# EAGLE design relay-attentuator (EAGLE 6.4)
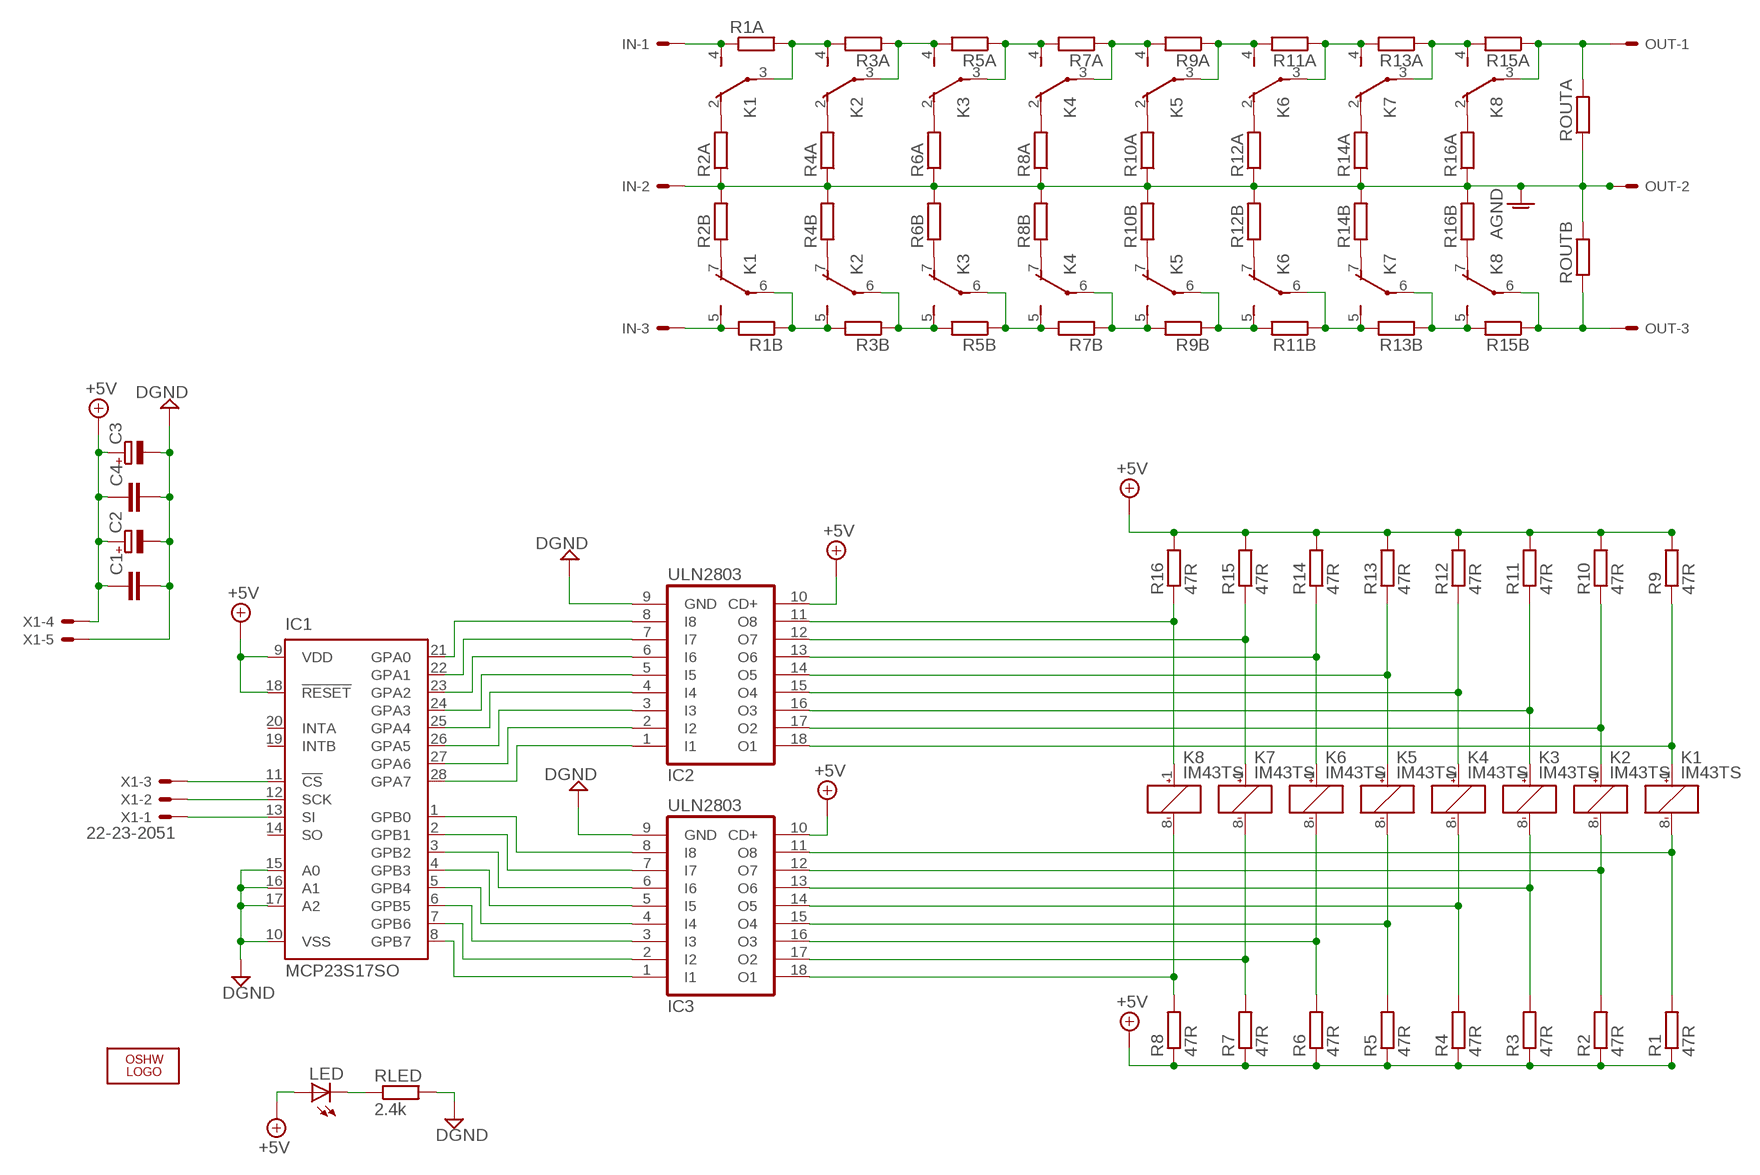
[diagram p0: schematic, sheet 1]

## Parts
C1  C-EUC1206  [C1206]
C2  CPOL-EUE3.5-8  [E3,5-8]
C3  CPOL-EUE3.5-8  [E3,5-8]
C4  C-EUC1206  [C1206]
IC1  MCP23S17SO  [SO28W]
IC2  ULN2803  ULN2803ADW  [SO-18W]
IC3  ULN2803  ULN2803ADW  [SO-18W]
IN  22-23-2031  [22-23-2031]
K1  IM43TS  [IM43TS]
K2  IM43TS  [IM43TS]
K3  IM43TS  [IM43TS]
K4  IM43TS  [IM43TS]
K5  IM43TS  [IM43TS]
K6  IM43TS  [IM43TS]
K7  IM43TS  [IM43TS]
K8  IM43TS  [IM43TS]
LED  LEDCHIPLED_1206  [CHIPLED_1206]
LOGO1  OSHW_LOGO_FILLX0200-NT  [OSHW_FILLX200_NOTEXT]
OUT  22-23-2031  [22-23-2031]
R1  47R  R-EU_R1206  [R1206]
R1A  R-EU_R1206  [R1206]
R1B  R-EU_R1206  [R1206]
R2  47R  R-EU_R1206  [R1206]
R2A  R-EU_R1206  [R1206]
R2B  R-EU_R1206  [R1206]
R3  47R  R-EU_R1206  [R1206]
R3A  R-EU_R1206  [R1206]
R3B  R-EU_R1206  [R1206]
R4  47R  R-EU_R1206  [R1206]
R4A  R-EU_R1206  [R1206]
R4B  R-EU_R1206  [R1206]
R5  47R  R-EU_R1206  [R1206]
R5A  R-EU_R1206  [R1206]
R5B  R-EU_R1206  [R1206]
R6  47R  R-EU_R1206  [R1206]
R6A  R-EU_R1206  [R1206]
R6B  R-EU_R1206  [R1206]
R7  47R  R-EU_R1206  [R1206]
R7A  R-EU_R1206  [R1206]
R7B  R-EU_R1206  [R1206]
R8  47R  R-EU_R1206  [R1206]
R8A  R-EU_R1206  [R1206]
R8B  R-EU_R1206  [R1206]
R9  47R  R-EU_R1206  [R1206]
R9A  R-EU_R1206  [R1206]
R9B  R-EU_R1206  [R1206]
R10  47R  R-EU_R1206  [R1206]
R10A  R-EU_R1206  [R1206]
R10B  R-EU_R1206  [R1206]
R11  47R  R-EU_R1206  [R1206]
R11A  R-EU_R1206  [R1206]
R11B  R-EU_R1206  [R1206]
R12  47R  R-EU_R1206  [R1206]
R12A  R-EU_R1206  [R1206]
R12B  R-EU_R1206  [R1206]
R13  47R  R-EU_R1206  [R1206]
R13A  R-EU_R1206  [R1206]
R13B  R-EU_R1206  [R1206]
R14  47R  R-EU_R1206  [R1206]
R14A  R-EU_R1206  [R1206]
R14B  R-EU_R1206  [R1206]
R15  47R  R-EU_R1206  [R1206]
R15A  R-EU_R1206  [R1206]
R15B  R-EU_R1206  [R1206]
R16  47R  R-EU_R1206  [R1206]
R16A  R-EU_R1206  [R1206]
R16B  R-EU_R1206  [R1206]
RLED  2.4k  R-EU_R1206  [R1206]
ROUTA  R-EU_R1206  [R1206]
ROUTB  R-EU_R1206  [R1206]
X1  22-23-2051  [22-23-2051]

## Nets
+5V: C1.1 C2.+ C3.+ C4.1 IC1.9(VDD) IC1.18(!RESET) IC2.10(CD+) IC3.10(CD+) LED.A R1.1 R2.1 R3.1 R4.1 R5.1 R6.1 R7.1 R8.1 R9.2 R10.2 R11.2 R12.2 R13.2 R14.2 R15.2 R16.2 X1.4
AGND: IN.2 OUT.2 R2A.1 R2B.2 R4A.1 R4B.2 R6A.1 R6B.2 R8A.1 R8B.2 R10A.1 R10B.2 R12A.1 R12B.2 R14A.1 R14B.2 R16A.1 R16B.2 ROUTA.1 ROUTB.2
ATT_INL: IN.1 K1.4(2:S) R1A.1
ATT_INR: IN.3 K1.5(3:S) R1B.2
CS: IC1.11(!CS) X1.3
DGND: C1.2 C2.- C3.- C4.2 IC1.10(VSS) IC1.15(A0) IC1.16(A1) IC1.17(A2) IC2.9(GND) IC3.9(GND) RLED.2 X1.5
N$1: IC2.11(O8) K8.1(1:+) R16.1
N$2: IC3.11(O8) K1.8(1:-) R1.2
N$3: IC3.17(O2) K7.8(1:-) R7.2
N$4: IC3.13(O6) K3.8(1:-) R3.2
N$5: IC3.14(O5) K4.8(1:-) R4.2
N$6: K2.7(3:O) R4B.1
N$7: K1.7(3:O) R2B.1
N$8: K1.2(2:O) R2A.2
N$9: IC3.18(O1) K8.8(1:-) R8.2
N$10: IC2.12(O7) K7.1(1:+) R15.1
N$11: IC2.13(O6) K6.1(1:+) R14.1
N$12: IC2.14(O5) K5.1(1:+) R13.1
N$13: IC2.15(O4) K4.1(1:+) R12.1
N$14: IC2.16(O3) K3.1(1:+) R11.1
N$15: IC2.17(O2) K2.1(1:+) R10.1
N$16: IC2.18(O1) K1.1(1:+) R9.1
N$17: K3.7(3:O) R6B.1
N$18: IC3.12(O7) K2.8(1:-) R2.2
N$19: IC3.16(O3) K6.8(1:-) R6.2
N$20: IC3.15(O4) K5.8(1:-) R5.2
N$21: K4.7(3:O) R8B.1
N$22: K5.7(3:O) R10B.1
N$23: K6.7(3:O) R12B.1
N$24: K7.7(3:O) R14B.1
N$25: K8.7(3:O) R16B.1
N$26: K2.2(2:O) R4A.2
N$27: K3.2(2:O) R6A.2
N$28: K4.2(2:O) R8A.2
N$29: K5.2(2:O) R10A.2
N$30: K6.2(2:O) R12A.2
N$31: K7.2(2:O) R14A.2
N$32: K8.2(2:O) R16A.2
N$33: IC1.28(GPA7) IC2.1(I1)
N$34: IC1.27(GPA6) IC2.2(I2)
N$35: IC1.26(GPA5) IC2.3(I3)
N$36: IC1.25(GPA4) IC2.4(I4)
N$37: IC1.24(GPA3) IC2.5(I5)
N$38: IC1.23(GPA2) IC2.6(I6)
N$39: IC1.22(GPA1) IC2.7(I7)
N$40: IC1.21(GPA0) IC2.8(I8)
N$41: IC1.8(GPB7) IC3.1(I1)
N$42: IC1.7(GPB6) IC3.2(I2)
N$43: IC1.6(GPB5) IC3.3(I3)
N$44: IC1.5(GPB4) IC3.4(I4)
N$45: IC1.4(GPB3) IC3.5(I5)
N$46: IC1.3(GPB2) IC3.6(I6)
N$47: IC1.2(GPB1) IC3.7(I7)
N$48: IC1.1(GPB0) IC3.8(I8)
N$50: K7.6(3:P) K8.5(3:S) R13B.1 R15B.2
N$52: K7.3(2:P) K8.4(2:S) R13A.1 R15A.2
N$61: K6.6(3:P) K7.5(3:S) R11B.1 R13B.2
N$67: LED.C RLED.1
N$69: K8.6(3:P) OUT.3 R15B.1 ROUTB.1
N$71: K8.3(2:P) OUT.1 R15A.1 ROUTA.2
N$76: K1.3(2:P) K2.4(2:S) R1A.2 R3A.2
N$80: K2.3(2:P) K3.4(2:S) R3A.1 R5A.2
N$82: K1.6(3:P) K2.5(3:S) R1B.1 R3B.2
N$114: K3.3(2:P) K4.4(2:S) R5A.1 R7A.2
N$115: K4.3(2:P) K5.4(2:S) R7A.1 R9A.2
N$116: K5.3(2:P) K6.4(2:S) R9A.1 R11A.2
N$117: K6.3(2:P) K7.4(2:S) R11A.1 R13A.2
N$120: K2.6(3:P) K3.5(3:S) R3B.1 R5B.2
N$121: K3.6(3:P) K4.5(3:S) R5B.1 R7B.2
N$122: K4.6(3:P) K5.5(3:S) R7B.1 R9B.2
N$123: K5.6(3:P) K6.5(3:S) R9B.1 R11B.2
SCK: IC1.12(SCK) X1.2
SI: IC1.13(SI) X1.1
Unconnected: IC1.14(SO) IC1.19(INTB) IC1.20(INTA)

## Library data of the parts
C1 C4 = rcl:C-EU: CAPACITOR, European symbol
C2 C3 = rcl:CPOL-EU: POLARIZED CAPACITOR, European symbol
IC1 = microchip:MCP23S17: http://ww1.microchip.com/downloads/en/DeviceDoc/21952a.pdf Source: http://ww1.microchip.com/downloads/en/DeviceDoc/21952a.pdf; MF: MICROCHIP; MPN: MCP23S17-E/SO; OC_FARNELL: unknown; OC_NEWARK: 31K2950
IC2 IC3 = uln-udn-mine:ULN2803ADW
IN OUT = con-molex:22-23-2031: .100" (2.54mm) Center Header - 3 Pin
K1-K8 = relay-te:IM
LED = led:LED: LED OSRAM: - CHIPLED LG R971, LG N971, LY N971, LG Q971, LY Q971, LO R971, LY R971 LH N974, LH R974 LS Q976, LO Q976, LY Q976 LO Q996 - Hyper CHIPLED LW Q18S LB Q993, LB Q99A, LB R99A - SideLED LS A670, LO A670, LY A670, LG A670, LP A670 LB A673, LV A673, LT A673, LW A673 LH A674 LY A675 LS A676, LA A676, LO A676, LY A676, LW A676 LS A679, LY A679, LG A679 - Hyper Micro SIDELED® LS Y876, LA Y876, LO Y876, LY Y876 LT Y87S - SmartLED LW L88C, LW L88S LB L89C, LB L89S, LG L890 LS L89K, LO L89K, LY L89K LS L896, LA L896, LO L896, LY L896 - TOPLED LS T670, LO T670, LY T670, LG T670, LP T670 LSG T670, LSP T670, LSY T670, LOP T670, LYG T670 LG T671, LOG T671, LSG T671 LB T673, LV T673, LT T673, LW T673 LH T674 LS T676, LA T676, LO T676, LY T676, LB T676, LH T676, LSB T676, LW T676 LB T67C, LV T67C, LT T67C, LS T67K, LO T67K, LY T67K, LW E67C LS E67B, LA E67B, LO E67B, LY E67B, LB E67C, LV E67C, LT E67C LW T67C LS T679, LY T679, LG T679 LS T770, LO T770, LY T770, LG T770, LP T770 LB T773, LV T773, LT T773, LW T773 LH T774 LS E675, LA E675, LY E675, LS T675 LS T776, LA T776, LO T776, LY T776, LB T776 LHGB T686 LT T68C, LB T68C - Hyper Mini TOPLED® LB M676 - Mini TOPLED Santana® LG M470 LS M47K, LO M47K, LY M47K Source: http://www.osram.convergy.de LUXEON: - LUMILED® LXK2-PW12-R00, LXK2-PW12-S00, LXK2-PW14-U00, LXK2-PW14-V00 LXK2-PM12-R00, LXK2-PM12-S00, LXK2-PM14-U00 LXK2-PE12-Q00, LXK2-PE12-R00, LXK2-PE12-S00, LXK2-PE14-T00, LXK2-PE14-U00 LXK2-PB12-K00, LXK2-PB12-L00, LXK2-PB12-M00, LXK2-PB14-N00, LXK2-PB14-P00, LXK2-PB14-Q00 LXK2-PR12-L00, LXK2-PR12-M00, LXK2-PR14-Q00, LXK2-PR14-R00 LXK2-PD12-Q00, LXK2-PD12-R00, LXK2-PD12-S00 LXK2-PH12-R00, LXK2-PH12-S00 LXK2-PL12-P00, LXK2-PL12-Q00, LXK2-PL12-R00 Source: www.luxeon.com KINGBRIGHT: KA-3528ASYC Source: www.kingbright.com
LOGO1 = ohw-logo:OSHW_LOGO_FILL
R1 R1A R1B R2 R2A R2B R3 R3A R3B R4 R4A R4B R5 R5A R5B R6 R6A R6B R7 R7A R7B R8 R8A R8B R9 R9A R9B R10 R10A R10B R11 R11A R11B R12 R12A R12B R13 R13A R13B R14 R14A R14B R15 R15A R15B R16 R16A R16B RLED ROUTA ROUTB = rcl:R-EU_: RESISTOR, European symbol
X1 = con-molex:22-23-2051: .100" (2.54mm) Center Header - 5 Pin; MF: MOLEX; MPN: 22-23-2051; OC_FARNELL: 1462952; OC_NEWARK: 38C9178

## Board
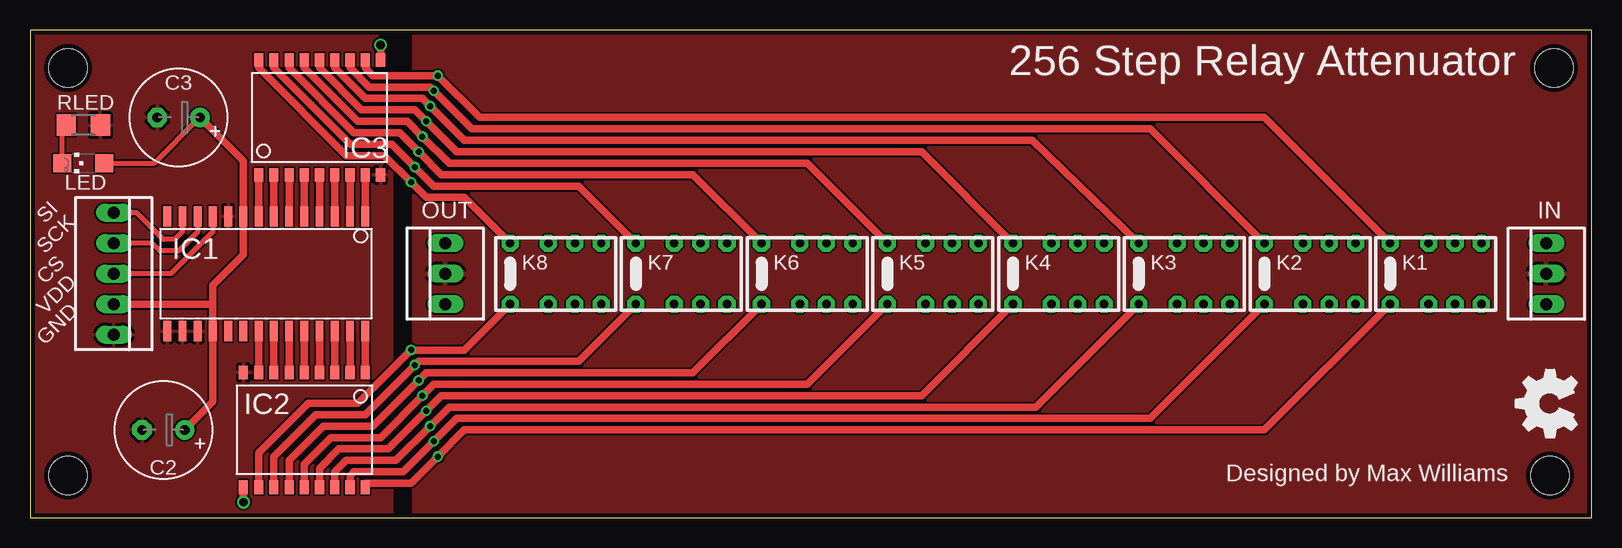
[diagram p1: board, top side]
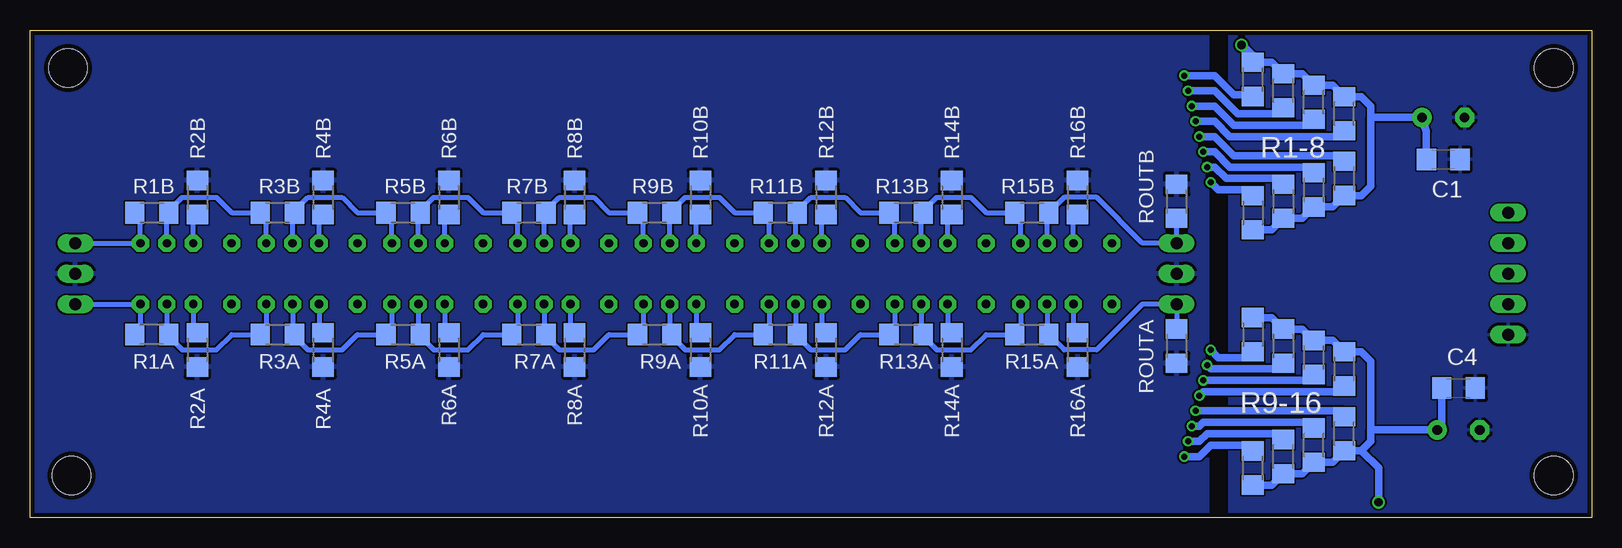
[diagram p2: board, bottom side, seen from below]

Size 130.16 x 40.63 mm. Coordinates in mm from the lower left corner, seen from the top.
Outline: 0,0 130.16,0 130.16,40.63 0,40.63 0,0
Copper layers (1*16): Top 0.0356mm / dielectric 1.5011mm / Bottom 0.0356mm
Design rules "LaenPCBOrder": minimum track width 6mil, minimum drill 13mil, track to track 6mil, track to pad 6mil, pad to pad 6mil, via to via 6mil, smd to smd 6mil, copper to edge 15mil, drill to drill 6mil, minimum pad ring 7mil, minimum via ring 7mil, stop-mask expansion 3mil, vias tented up to drill 0mil, thermal gap 10mil
Holes 3.2 mm at 127,37.47 126.68,3.49 3.17,37.47 3.17,3.49

### Footprints (pad centres in the part's own frame; a part is rotated, then mirrored left to right if it is on the bottom)
C1206 = smd 1.6 x 1.8: 1 -1.4,0; 2 1.4,0
E3,5-8 = drill 0.813 pad 1.6: + -1.778,0 | drill 0.813 pad 1.6 octagon: - 1.778,0
SO28W = smd 0.65 x 1.7: 1 -7.62,-4.78; 2 -6.35,-4.78; 3 -5.08,-4.78; 4 -3.81,-4.78; 5 -2.54,-4.78; 6 -1.27,-4.78; 7 0,-4.78; 8 1.27,-4.78; 9 2.54,-4.78; 10 3.81,-4.78; 11 5.08,-4.78; 12 6.35,-4.78; 13 7.62,-4.78; 14 8.89,-4.78; 15 8.89,4.78; 16 7.62,4.78; 17 6.35,4.78; 18 5.08,4.78; 19 3.81,4.78; 20 2.54,4.78; 21 1.27,4.78; 22 0,4.78; 23 -1.27,4.78; 24 -2.54,4.78; 25 -3.81,4.78; 26 -5.08,4.78; 27 -6.35,4.78; 28 -7.62,4.78
SO-18W = smd 0.762 x 1.143: 1 -5.08,-4.788; 2 -3.81,-4.788; 3 -2.54,-4.788; 4 -1.27,-4.788; 5 0,-4.788; 6 1.27,-4.788; 7 2.54,-4.788; 8 3.81,-4.788; 9 5.08,-4.788; 10 5.08,4.788; 11 3.81,4.788; 12 2.54,4.788; 13 1.27,4.788; 14 0,4.788; 15 -1.27,4.788; 16 -2.54,4.788; 17 -3.81,4.788; 18 -5.08,4.788
22-23-2031 = drill 1 long: 1 -2.54,0; 2 0,0; 3 2.54,0
IM43TS = drill 0.7 pad 1.422 octagon: 1 2.54,-3.81; 2 2.54,-0.61; 3 2.54,1.59; 4 2.54,3.79; 5 -2.54,3.79; 6 -2.54,1.59; 7 -2.54,-0.61; 8 -2.54,-3.81
CHIPLED_1206 = smd 1.5 x 1.5: A 0,-1.75; C 0,1.75
R1206 = smd 1.6 x 1.803: 1 -1.422,0; 2 1.422,0
22-23-2051 = drill 1 long: 1 -5.08,0; 2 -2.54,0; 3 0,0; 4 2.54,0; 5 5.08,0

### Placement (x,y rotation side)
C1  12.38,29.84 0 bottom
C2  11.11,7.3 180 top
C3  12.38,33.34 180 top
C4  11.11,10.79 0 bottom
IC1  20.32,20.32 180 top
IC2  22.86,7.3 180 top
IC3  24.13,33.34 0 top
IN  126.36,20.32 90 top
K1  117.16,20.32 270 top
K2  106.68,20.32 270 top
K3  96.2,20.32 270 top
K4  85.72,20.32 270 top
K5  75.25,20.32 270 top
K6  64.77,20.32 270 top
K7  54.29,20.32 270 top
K8  43.81,20.32 270 top
LED  4.45,29.53 90 top
LOGO1  128.91,6.67 90 top
OUT  34.61,20.32 90 top
R1  28.26,36.51 270 bottom
R1A  120.02,15.24 0 bottom
R1B  120.02,25.4 180 bottom
R2  25.72,35.56 270 bottom
R2A  116.2,13.97 90 bottom
R2B  116.2,26.67 90 bottom
R3  23.18,34.61 270 bottom
R3A  109.54,15.24 180 bottom
R3B  109.54,25.4 180 bottom
R4  20.64,33.66 270 bottom
R4A  105.73,13.97 90 bottom
R4B  105.73,26.67 90 bottom
R5  20.64,28.26 90 bottom
R5A  99.06,15.24 180 bottom
R5B  99.06,25.4 180 bottom
R6  23.18,27.3 90 bottom
R6A  95.25,13.97 90 bottom
R6B  95.25,26.67 90 bottom
R7  25.72,26.35 90 bottom
R7A  88.58,15.24 180 bottom
R7B  88.58,25.4 180 bottom
R8  28.26,25.4 90 bottom
R8A  84.77,13.97 90 bottom
R8B  84.77,26.67 90 bottom
R9  28.26,4.13 270 bottom
R9A  78.11,15.24 180 bottom
R9B  78.11,25.4 180 bottom
R10  25.72,5.08 270 bottom
R10A  74.3,13.97 90 bottom
R10B  74.3,26.67 90 bottom
R11  23.18,6.03 270 bottom
R11A  67.63,15.24 180 bottom
R11B  67.63,25.4 180 bottom
R12  20.64,6.99 270 bottom
R12A  63.82,13.97 90 bottom
R12B  63.82,26.67 90 bottom
R13  20.64,12.38 90 bottom
R13A  57.15,15.24 180 bottom
R13B  57.15,25.4 180 bottom
R14  23.18,13.34 90 bottom
R14A  53.34,13.97 90 bottom
R14B  53.34,26.67 90 bottom
R15  25.72,14.29 90 bottom
R15A  46.67,15.24 180 bottom
R15B  46.67,25.4 180 bottom
R16  28.26,15.24 90 bottom
R16A  42.86,13.97 90 bottom
R16B  42.86,26.67 90 bottom
RLED  4.45,32.7 0 top
ROUTA  34.61,14.29 90 bottom
ROUTB  34.61,26.35 90 bottom
X1  6.99,20.32 270 top

### Tracks (layer width: path | path; a pad name or v marks a point on that pad's centre or on a via)
+5V  (via drill 0.7 pad 0.25)
  Top 0.406: LED.A 10.35,29.53 C3.+
  Top 0.61: v17.78,1.27 IC2.10 | IC3.10 v29.21,39.37 | 15.24,17.78 IC1.18 15.24,9.65 C2.+ | 15.24,17.78 15.24,19.37 17.78,21.91 IC1.9 17.78,29.72 C3.+ | X1.4 15.24,17.78
  Bottom 0.61: R1.1 26.67,37.93 R2.1 24.13,36.98 R3.1 21.59,36.03 R4.1 | R8.1 26.67,23.98 R7.1 24.13,24.93 R6.1 21.59,25.88 R5.1 19.2,26.84 18.41,27.62 18.41,33.34 | R9.2 26.67,2.71 R10.2 24.13,3.66 R11.2 21.59,4.61 R12.2 19.2,5.56 | R16.2 26.67,16.66 R15.2 24.13,15.71 R14.2 21.59,14.76 R13.2 19.2,13.8 18.41,13.02 18.41,7.3 | R4.1 20.47,35.08 | R4.1 19.2,35.08 18.41,34.29 18.41,33.34 | 19.2,5.56 18.41,6.35 18.41,7.3 | 19.2,5.56 17.78,4.14 v17.78,1.27 | 18.41,33.34 C3.+ 13.78,32.2 C1.1 | 18.41,7.3 C2.+ 12.51,7.68 C4.1
  Bottom 0.813: R1.1 28.26,38.42 v29.21,39.37
AGND
  pour Top: 32.07,40.32 129.86,40.32 129.86,0.32 32.07,0.32
  pour Bottom: 32.07,40.32 129.86,40.32 129.86,0.32 32.07,0.32
ATT_INL
  Bottom 0.406: R1A.1 120.95,15.73 K1.4 IN.1
ATT_INR
  Bottom 0.406: R1B.2 120.95,24.91 K1.5 IN.3
CS
  Top 0.406: IC1.11 15.24,23.81 11.75,20.32 X1.3
DGND
  pour Bottom: 0.32,40.32 0.32,0.32 30.16,0.32 30.16,40.32
  pour Top: 0.32,40.32 0.32,0.32 30.16,0.32 30.16,40.32
N$1  (via drill 0.5 pad 0.25)
  Top 0.61: K8.1 36.18,13.95 31.73,13.95 v31.75,13.97 27.3,9.53 23.18,9.53 19.05,5.4 IC2.11
  Bottom 0.61: R16.1 28.26,13.34 31.11,13.34 v31.75,13.97
N$2  (via drill 0.5 pad 0.25)
  Top 0.61: K1.8 102.87,33.34 37.47,33.34 v33.97,36.83 28.57,36.83 27.94,37.47 IC3.11
  Bottom 0.61: 28.26,34.61 R1.2 28.26,35.24 29.84,35.24 31.43,36.83 v33.97,36.83
N$3  (via drill 0.5 pad 0.25)
  Top 0.61: K7.8 45.72,27.62 33.66,27.62 v32.07,29.21 30.16,31.11 26.67,31.11 20.32,37.47 IC3.17
  Bottom 0.61: 25.72,27.62 R7.2 25.72,28.26 30.48,28.26 31.43,29.21 v32.07,29.21
N$4  (via drill 0.5 pad 0.25)
  Top 0.61: K3.8 83.5,31.43 36.2,31.43 v33.34,34.29 32.7,34.92 27.94,34.92 25.4,37.47 IC3.13
  Bottom 0.61: R3.2 23.18,32.7 29.84,32.7 31.43,34.29 v33.34,34.29
N$5  (via drill 0.5 pad 0.25)
  Top 0.61: K4.8 74.3,30.48 35.56,30.48 v33.02,33.02 32.07,33.97 27.62,33.97 24.13,37.47 IC3.14
  Bottom 0.61: R4.2 20.64,31.75 30.16,31.75 31.43,33.02 v33.02,33.02
N$6
  Bottom 0.406: K2.7 106.07,24.59 R4B.1
N$7
  Bottom 0.406: K1.7 116.55,24.59 R2B.1
N$8
  Bottom 0.406: K1.2 116.55,16.05 R2A.2
N$9  (via drill 0.5 pad 0.25)
  Top 0.61: K8.8 36.2,26.67 33.02,26.67 v31.75,27.94 29.53,30.16 26.35,30.16 19.05,37.47 IC3.18
  Bottom 0.61: R8.2 28.26,27.3 31.11,27.3 v31.75,27.94
N$10  (via drill 0.5 pad 0.25)
  Top 0.61: K7.1 45.72,13.02 32.38,13.02 v32.07,12.7 27.94,8.57 23.81,8.57 20.32,5.08 IC2.12
  Bottom 0.61: R15.1 25.72,12.38 31.75,12.38 v32.07,12.7
N$11  (via drill 0.5 pad 0.25)
  Top 0.61: K6.1 55.24,12.06 33.02,12.06 v32.38,11.43 28.57,7.62 24.45,7.62 21.59,4.76 IC2.13
  Bottom 0.61: R14.1 23.18,11.43 v32.38,11.43
N$12  (via drill 0.5 pad 0.25)
  Top 0.61: K5.1 64.77,11.11 33.66,11.11 v32.7,10.16 29.21,6.67 25.08,6.67 22.86,4.45 IC2.14
  Bottom 0.61: R13.1 20.64,10.48 32.38,10.48 v32.7,10.16
N$13  (via drill 0.5 pad 0.25)
  Top 0.61: K4.1 74.3,10.16 34.29,10.16 v33.02,8.89 29.84,5.71 25.72,5.71 24.13,4.13 IC2.15
  Bottom 0.61: R12.1 20.64,8.89 v33.02,8.89
N$14  (via drill 0.5 pad 0.25)
  Top 0.61: K3.1 83.82,9.21 34.92,9.21 v33.34,7.62 30.48,4.76 26.35,4.76 25.4,3.81 IC2.16
  Bottom 0.61: R11.1 23.18,7.94 32.38,7.94 32.7,7.62 v33.34,7.62
N$15  (via drill 0.5 pad 0.25)
  Top 0.61: K2.1 93.34,8.26 35.56,8.26 v33.66,6.35 31.11,3.81 26.99,3.81 26.67,3.49 IC2.17
  Bottom 0.61: R10.1 25.72,6.99 32.07,6.99 32.7,6.35 v33.66,6.35
N$16  (via drill 0.5 pad 0.25)
  Top 0.61: K1.1 102.87,7.3 36.2,7.3 v33.97,5.08 31.75,2.86 27.94,2.86 IC2.18
  Bottom 0.61: 28.26,6.03 R9.1 28.74,5.55 | 28.74,5.23 28.74,5.55 | 28.74,5.55 28.26,6.03 | 28.26,6.03 31.75,6.03 32.7,5.08 v33.97,5.08
N$17
  Bottom 0.406: K3.7 95.59,24.59 R6B.1
N$18  (via drill 0.5 pad 0.25)
  Top 0.61: K2.8 93.34,32.38 36.83,32.38 v33.66,35.56 33.34,35.88 28.26,35.88 26.67,37.47 IC3.12
  Bottom 0.61: 25.72,33.97 R2.2 25.72,33.66 29.53,33.66 31.43,35.56 v33.66,35.56
N$19  (via drill 0.5 pad 0.25)
  Top 0.61: K6.8 55.24,28.57 34.29,28.57 v32.38,30.48 30.8,32.07 26.99,32.07 21.59,37.47 IC3.16
  Bottom 0.61: R6.2 23.18,29.21 30.16,29.21 31.43,30.48 v32.38,30.48
N$20  (via drill 0.5 pad 0.25)
  Top 0.61: K5.8 64.77,29.53 34.92,29.53 v32.7,31.75 31.43,33.02 27.3,33.02 22.86,37.47 IC3.15
  Bottom 0.61: R5.2 20.64,30.16 29.84,30.16 31.43,31.75 v32.7,31.75
N$21
  Bottom 0.406: K4.7 85.11,24.59 R8B.1
N$22
  Bottom 0.406: K5.7 74.64,24.59 R10B.1
N$23
  Bottom 0.406: K6.7 64.16,24.59 R12B.1
N$24
  Bottom 0.406: K7.7 53.68,24.59 R14B.1
N$25
  Bottom 0.406: K8.7 43.2,24.59 R16B.1
N$26
  Bottom 0.406: K2.2 106.07,16.05 R4A.2
N$27
  Bottom 0.406: K3.2 95.59,16.05 R6A.2
N$28
  Bottom 0.406: K4.2 85.11,16.05 R8A.2
N$29
  Bottom 0.406: K5.2 74.64,16.05 R10A.2
N$30
  Bottom 0.406: K6.2 64.16,16.05 R12A.2
N$31
  Bottom 0.406: K7.2 53.68,16.05 R14A.2
N$32
  Bottom 0.406: K8.2 43.2,16.05 R16A.2
N$33
  Top 0.61: IC1.28 IC2.1
N$34
  Top 0.61: IC1.27 IC2.2
N$35
  Top 0.61: IC1.26 IC2.3
N$36
  Top 0.61: IC1.25 IC2.4
N$37
  Top 0.61: IC1.24 IC2.5
N$38
  Top 0.61: IC1.23 IC2.6
N$39
  Top 0.61: IC1.22 IC2.7
N$40
  Top 0.61: IC1.21 IC2.8
N$41
  Top 0.61: IC1.8 IC3.1
N$42
  Top 0.61: IC1.7 IC3.2
N$43
  Top 0.61: IC1.6 IC3.3
N$44
  Top 0.61: IC1.5 IC3.4
N$45
  Top 0.61: IC1.4 IC3.5
N$46
  Top 0.61: IC1.3 IC3.6
N$47
  Top 0.61: IC1.2 IC3.7
N$48
  Top 0.61: IC3.8 IC1.1
N$50
  Bottom 0.406: K7.6 55.88,25.25 R13B.1 55.73,25.55 54.61,26.67 51.75,26.67 50.48,25.4 R15B.2 47.6,24.91 K8.5
N$52
  Bottom 0.406: K8.4 47.6,15.73 R15A.2 50.48,15.24 51.75,13.97 54.61,13.97 55.73,15.09 R13A.1 55.88,15.39 K7.3
N$61
  Bottom 0.406: K6.6 66.36,25.25 R11B.1 66.21,25.55 65.09,26.67 62.23,26.67 60.96,25.4 R13B.2 58.08,24.91 K7.5
N$67
  Top 0.406: LED.C 2.69,32.37 RLED.1
N$69
  Bottom 0.406: K8.6 45.41,25.25 R15B.1 43.98,26.67 41.27,26.67 37.47,22.86 OUT.3 ROUTB.1
N$71
  Bottom 0.406: K8.3 45.41,15.39 R15A.1 43.98,13.97 41.27,13.97 37.47,17.78 OUT.1 ROUTA.2
N$76
  Bottom 0.406: K1.3 118.75,15.39 R1A.2 118.59,15.09 117.47,13.97 114.62,13.97 113.35,15.24 R3A.2 110.47,15.73 K2.4
N$80
  Bottom 0.406: K2.3 108.27,15.39 R3A.1 108.11,15.09 107,13.97 104.14,13.97 102.87,15.24 R5A.2 99.99,15.73 K3.4
N$82
  Bottom 0.406: K1.6 118.75,25.25 R1B.1 118.59,25.55 117.47,26.67 114.62,26.67 113.35,25.4 R3B.2 110.47,24.91 K2.5
N$114
  Bottom 0.406: K3.3 97.79,15.39 R5A.1 97.64,15.09 96.52,13.97 93.66,13.97 92.39,15.24 R7A.2 89.52,15.73 K4.4
N$115
  Bottom 0.406: K4.3 87.31,15.39 R7A.1 87.16,15.09 86.04,13.97 83.19,13.97 81.92,15.24 R9A.2 79.04,15.73 K5.4
N$116
  Bottom 0.406: K5.3 76.84,15.39 R9A.1 76.68,15.09 75.56,13.97 72.71,13.97 71.44,15.24 R11A.2 68.56,15.73 K6.4
N$117
  Bottom 0.406: K6.3 66.36,15.39 R11A.1 66.21,15.09 65.09,13.97 62.23,13.97 60.96,15.24 R13A.2 58.08,15.73 K7.4
N$120
  Bottom 0.406: K2.6 108.27,25.25 R3B.1 108.11,25.55 107,26.67 104.14,26.67 102.87,25.4 R5B.2 99.99,24.91 K3.5
N$121
  Bottom 0.406: K3.6 97.79,25.25 R5B.1 97.64,25.55 96.52,26.67 93.66,26.67 92.39,25.4 R7B.2 89.52,24.91 K4.5
N$122
  Bottom 0.406: K4.6 87.31,25.25 R7B.1 87.16,25.55 86.04,26.67 83.19,26.67 81.92,25.4 R9B.2 79.04,24.91 K5.5
N$123
  Bottom 0.406: K5.6 76.84,25.25 R9B.1 76.68,25.55 75.56,26.67 72.71,26.67 71.44,25.4 R11B.2 68.56,24.91 K6.5
SCK
  Top 0.406: IC1.12 13.97,23.81 12.38,22.23 10.79,22.23 10.16,22.86 X1.2
SI
  Top 0.406: IC1.13 12.7,23.81 12.06,23.18 11.11,23.18 8.89,25.4 X1.1

### Text on the board
tNames: 256 Step Relay Attenuator | SI | SCK | CS | VDD | GND | Designed by Max Williams
bNames: R1-8 | R9-16